# EasyEDA schematic Smart socket circuit.json

## Sheets
1 Sheet_PSU
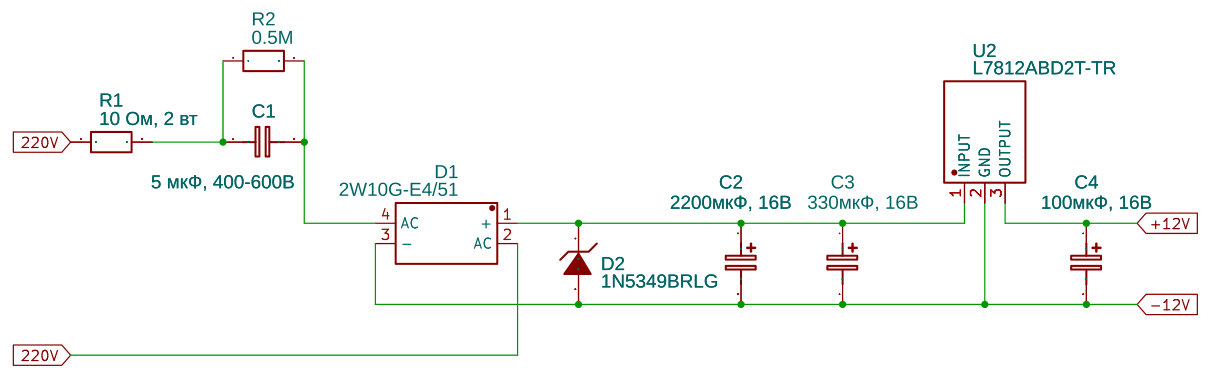
[diagram p0: Sheet_PSU]
2 Sheet_Prototype
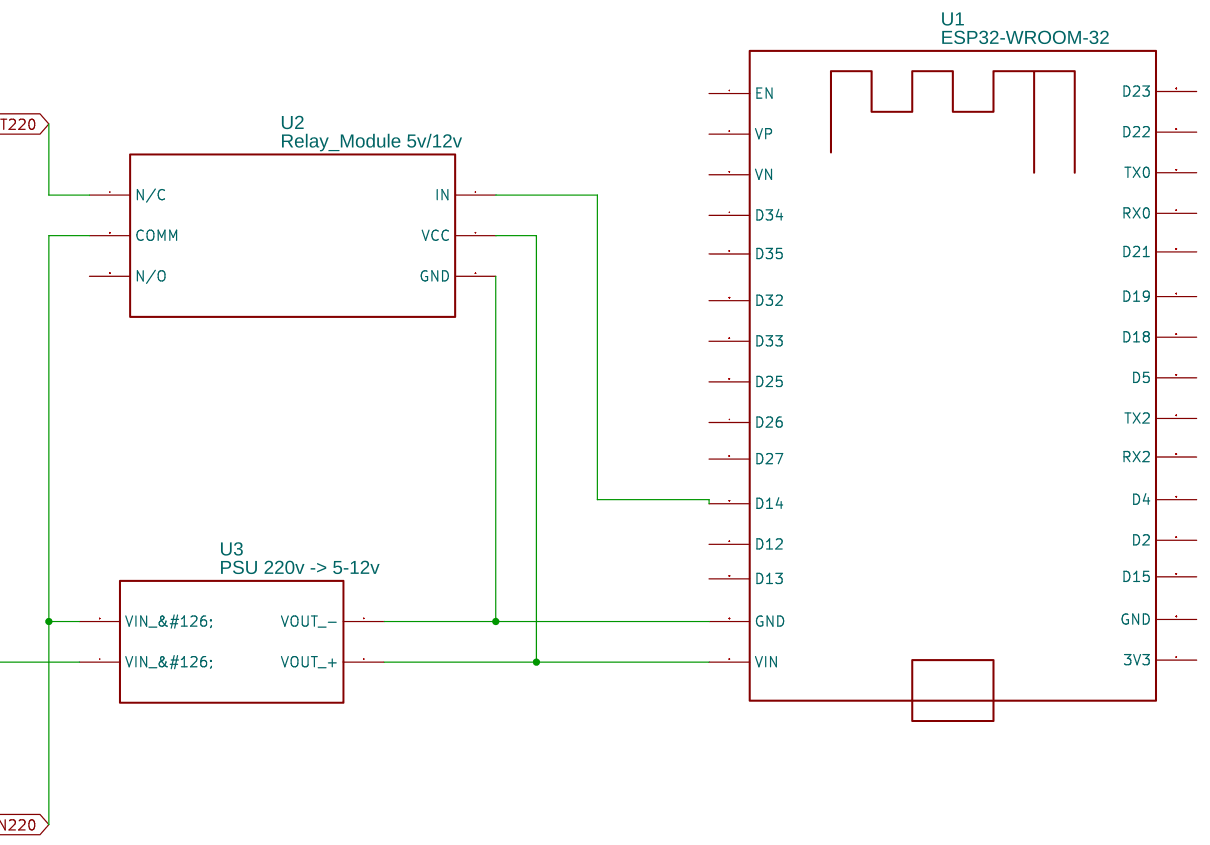
[diagram p1: Sheet_Prototype]

## Parts
sheet Sheet_Prototype
U1  ESP32-WROOM-32
U2#2  Relay_Module 5v/12v
U3  PSU 220v -> 5-12v
sheet Sheet_PSU
C1  5 мкФ, 400-600В  [C0603]
C2  2200мкФ, 16В  [CAP-D3.0×F1.5]
C3  330мкФ, 16В  [CAP-D3.0×F1.5]
C4  100мкФ, 16В  [CAP-D3.0×F1.5]
D1  2W10G-E4/51  [DIO-BG-TH_WOG-4]
D2  1N5349BRLG  [DO-27_BD3.5-L8.6-P12.60-D1.3-RD]
R1  10 Ом, 2 вт  [R0603]
R2  0.5M  [R0603]
U2  L7812ABD2T-TR  [TO-263-3_L10.2-W10.7-P5.08-LS16.2-BR]

## Library data of the parts
U1 = ESP32-WROOM-32: Contributor: Zahar Parhomchuk
U2#2 = Relay_Module: Contributor: Zahar Parhomchuk
U3 = PSU: Contributor: zartavr
C1 = C_0603_EU: Contributor: LCEDA_Lib
C2-C4 = CE_TH_D3.0×F1.5_EU: Contributor: LCEDA_Lib
D1 = 2W10G-E4/51: Supplier: LCSC; Supplier Part: C266671; Manufacturer: Vishay Intertech; Contributor: LCSC; JLCPCB Part Class: Extended Part
D2 = 1N5349BRLG: Supplier: LCSC; Manufacturer: ON; Supplier Part: C9078; JLCPCB Part Class: Extended Part
R1 R2 = R_0603_EU: Contributor: LCEDA_Lib
U2 = L7812ABD2T-TR: Supplier: LCSC; Supplier Part: C186698; Manufacturer: STMicroelectronics; Contributor: LCSC; JLCPCB Part Class: Extended Part

## Nets
220V: D1.2(AC) R1.1
+12V: C4.1 U2.3(OUTPUT)
-12V: C2.2 C3.2 C4.2 D1.3(-) D2.2(A) U2.2(GND)
VIN220: U2#2.4(N/C) U2#2.5(COMM) U3.3(VIN &#126;) U3.4(VIN &#126;)
Net-(C1-1): C1.1 R1.2 R2.1
Net-(C1-2): C1.2 D1.4(AC) R2.2
Net-(C2-1): C2.1 C3.1 D1.1(+) D2.1(C) U2.1(INPUT)
Net-(U1-12): U1.12(D14) U2#2.1(IN)
Net-(U1-13): U1.13(GND) U2#2.3(GND) U3.2(VOUT -)
Net-(U1-14): U1.14(VIN) U2#2.2(VCC) U3.1(VOUT +)

Not connected (* = marked no-connect by the designer): U1 1(EN) 2(VP) 3(VN) 4(D34) 5(D35) 6(D27) 7(D26) 8(D25) 9(D33) 10(D32) 11(D12) 15(D13) 16(D15) 17(3V3) 18(GND) 19(D4) 20(D2) 21(D19) 22(D18) 23(D5) 24(TX2) 25(RX2) 26(D21) 27(RX0) 28(TX0) 29(D22) 30(D23); U2#2 6(N/O)
